# EAGLE design motherboard (EAGLE 7.2.0)
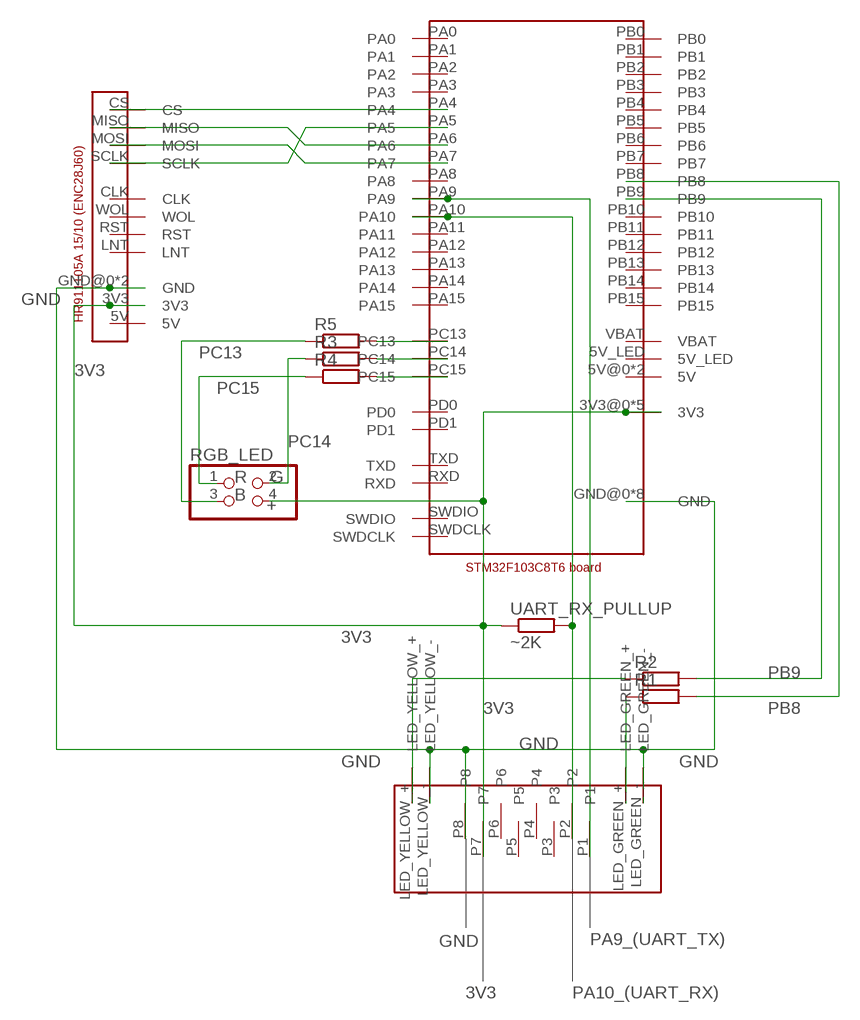
[diagram p0: schematic, sheet 1]

## Parts
R1  R-EU_R1206  [R1206]
R2  R-EU_R1206  [R1206]
R3  R-EU_R1206  [R1206]
R4  R-EU_R1206  [R1206]
R5  R-EU_R1206  [R1206]
RGB_LED  PINHD-2X2  [2X02]
U$1  HANRUN_HR911105A_15/10  [HANRUN_HR911105A_15/10]
U$2  STM32F103C8T6_BOARD_BLACK  [STM32F103C8T6_BOARD_BLACK]
U$3  RJHSE-5481_(RJ45)  [RJHSE-5481_(RJ45)]
UART_RX_PULLUP  ~2K  R-EU_R1206  [R1206]

## Nets
3V3: RGB_LED.4 U$1.3V3 U$2.3V3@0(3V3) U$2.3V3@1(3V3) U$2.3V3@2(3V3) U$2.3V3@3(3V3) U$2.3V3@4(3V3) U$3.P7 UART_RX_PULLUP.1
GND: U$1.GND@0(GND) U$1.GND@1(GND) U$2.GND@0(GND) U$2.GND@1(GND) U$2.GND@2(GND) U$2.GND@3(GND) U$2.GND@4(GND) U$2.GND@5(GND) U$2.GND@6(GND) U$2.GND@7(GND) U$3.LED_GREEN_- U$3.LED_YELLOW_- U$3.P8
N$2: U$1.CS U$2.PA4
N$3: U$1.SCLK U$2.PA5
N$4: U$1.MISO U$2.PA6
N$5: U$1.MOSI U$2.PA7
N$9: R1.1 U$3.LED_GREEN_+
N$16: R4.2 U$2.PC15
N$17: R3.2 U$2.PC14
N$18: R5.2 U$2.PC13
PA9_(UART_TX): U$2.PA9 U$3.P1
PA10_(UART_RX): U$2.PA10 U$3.P2 UART_RX_PULLUP.2
PB8: R1.2 U$2.PB8
PB9: R2.2 U$2.PB9
PB9R: R2.1 U$3.LED_YELLOW_+
PC13: R5.1 RGB_LED.3
PC14: R3.1 RGB_LED.2
PC15: R4.1 RGB_LED.1
Unconnected: U$1.5V U$1.CLK U$1.LNT U$1.RST U$1.WOL U$2.5V@0(5V) U$2.5V@1(5V) U$2.5V_LED U$2.PA0 U$2.PA1 U$2.PA2 U$2.PA3 U$2.PA8 U$2.PA11 U$2.PA12 U$2.PA13 U$2.PA14 U$2.PA15 U$2.PB0 U$2.PB1 U$2.PB2 U$2.PB3 U$2.PB4 U$2.PB5 U$2.PB6 U$2.PB7 U$2.PB10 U$2.PB11 U$2.PB12 U$2.PB13 U$2.PB14 U$2.PB15 U$2.PD0 U$2.PD1 U$2.RXD U$2.SWDCLK U$2.SWDIO U$2.TXD U$2.VBAT U$3.P3 U$3.P4 U$3.P5 U$3.P6

## Notes on the sheet
- R | G
- B
- +

## Library data of the parts
R1-R5 UART_RX_PULLUP = resistor:R-EU_: RESISTOR, European symbol
RGB_LED = pinhead:PINHD-2X2: PIN HEADER
U$1 = ut-boards:HANRUN_HR911105A_15/10
U$2 = ut-boards:STM32F103C8T6_BOARD_BLACK
U$3 = ut-connectors:RJHSE-5481_(RJ45)

## Board
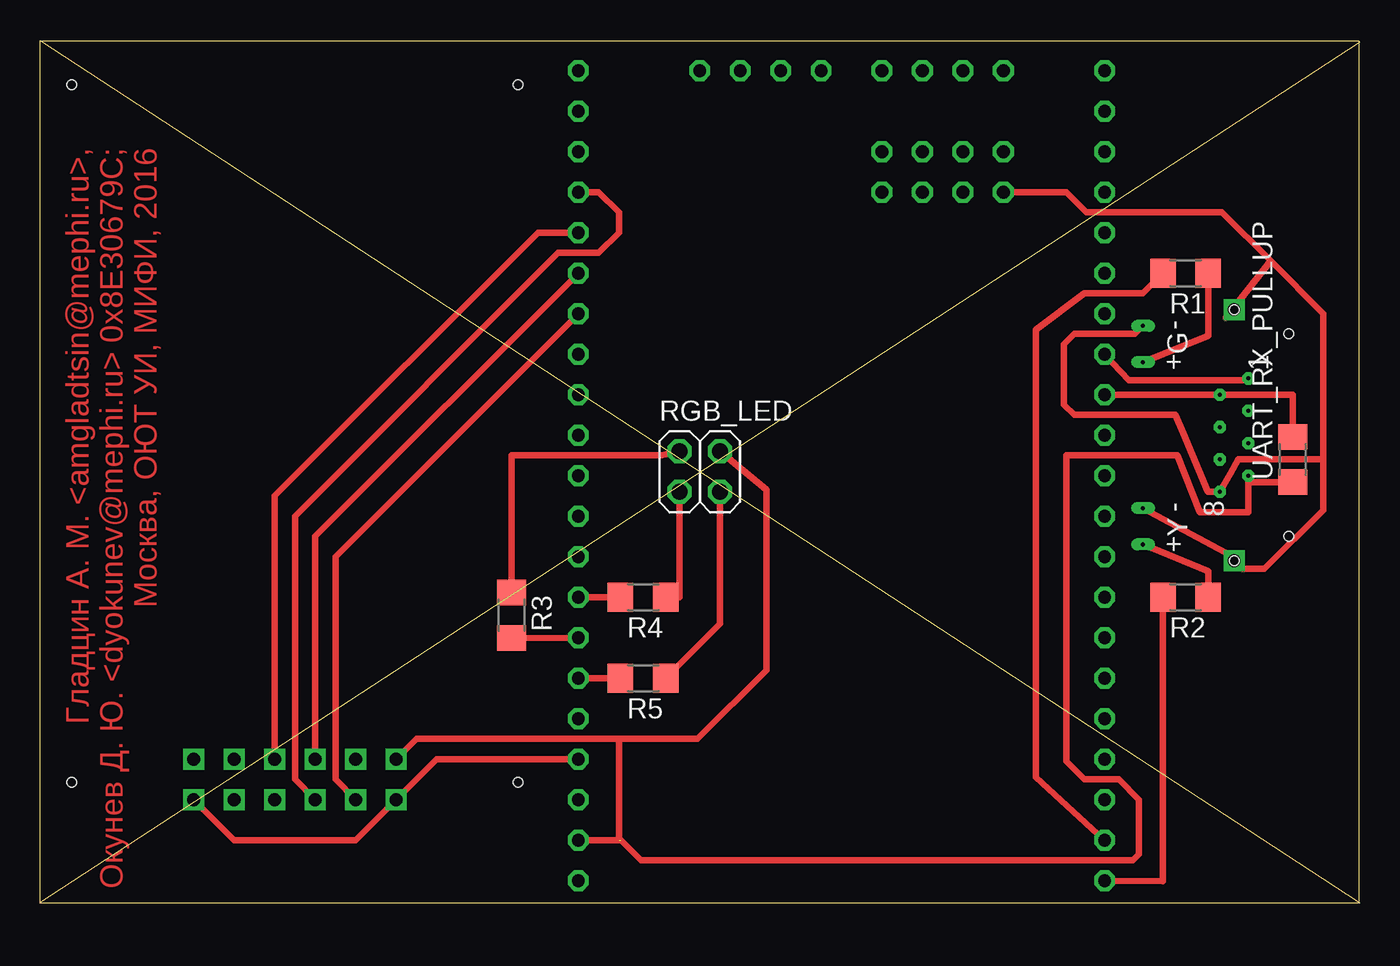
[diagram p1: board, top side]
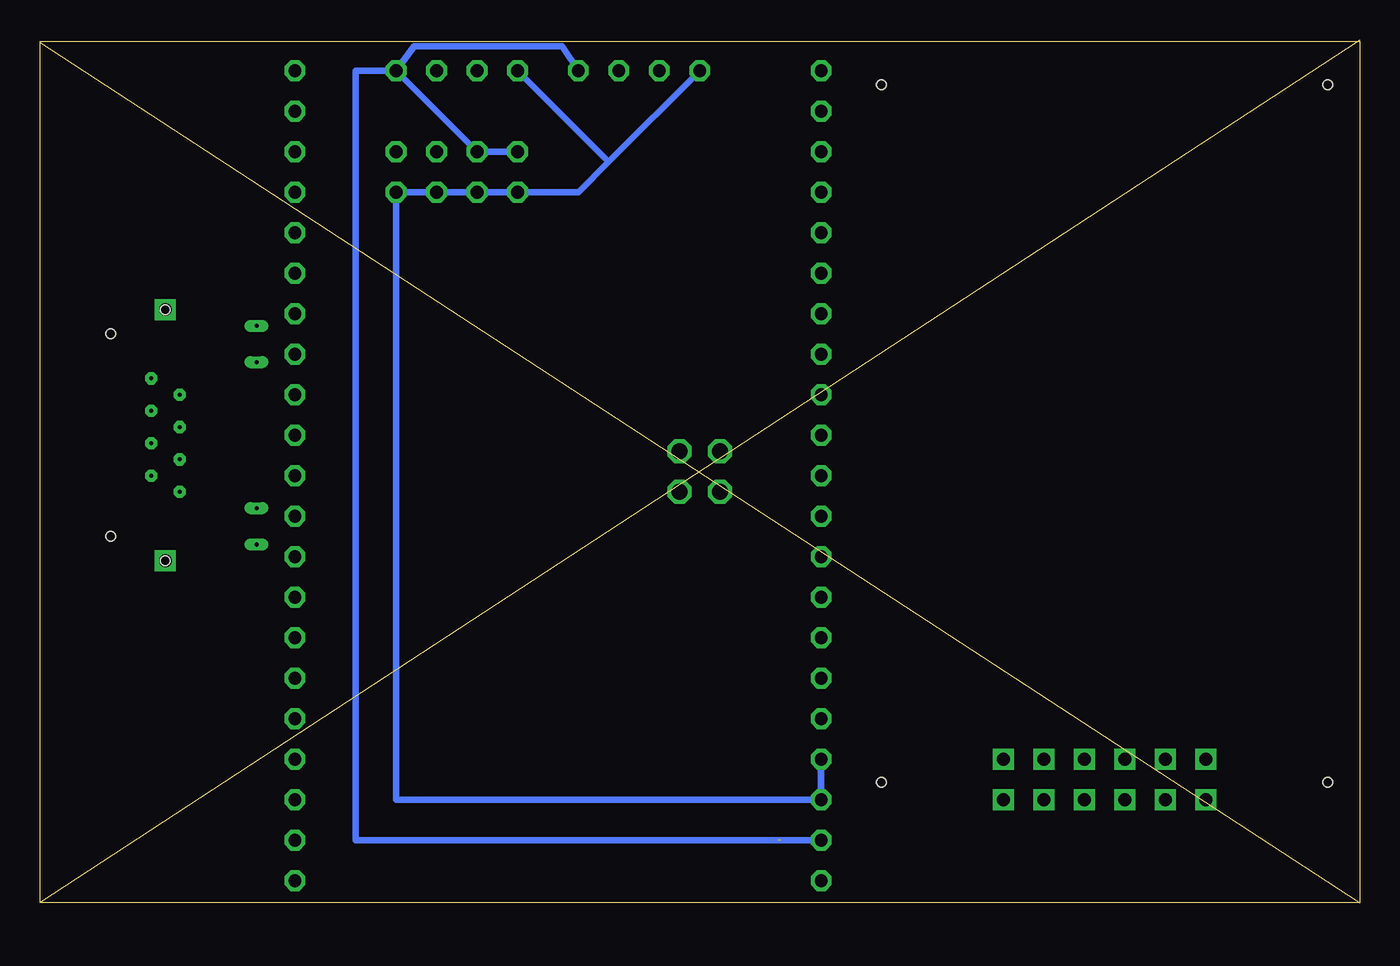
[diagram p2: board, bottom side, seen from below]

Size 82.8 x 54.1 mm. Coordinates in mm from the lower left corner, seen from the top.
Outline: 0,0 82.78,0 82.78,54.03 0,54.03 0,0
Outline: 0,54.1 82.8,0
Outline: 82.8,53.98 0,0
Copper layers (1*16): Top 0.035mm / dielectric 1.5mm / Bottom 0.035mm
Design rules "default": minimum track width 10mil, minimum drill 24mil, track to track 8mil, track to pad 8mil, pad to pad 8mil, via to via 8mil, smd to smd 8mil, copper to edge 40mil, drill to drill 8mil, minimum pad ring 10mil, minimum via ring 8mil, stop-mask expansion 4mil, vias tented up to drill 0mil, thermal gap 10mil

### Footprints (pad centres in the part's own frame; a part is rotated, then mirrored left to right if it is on the bottom)
R1206 = smd 1.6 x 1.803: 1 -1.422,0; 2 1.422,0
2X02 = drill 1.016 octagon: 1 -1.27,-1.27; 2 -1.27,1.27; 3 1.27,-1.27; 4 1.27,1.27
HANRUN_HR911105A_15/10 = drill 0.8 square: 3V3 -6.35,-19.05; 5V 6.35,-19.05; CLK 3.81,-21.59; CS -3.81,-21.59; GND@0 -6.35,-21.59; GND@1 6.35,-21.59; LNT 3.81,-19.05; MISO 1.27,-19.05; MOSI -1.27,-21.59; RST -3.81,-19.05; SCLK -1.27,-19.05; WOL 1.27,-21.59 | hole 0.6: -14,-20.5; 14,-20.5; -14,23.25; 14,23.25
STM32F103C8T6_BOARD_BLACK = drill 0.8 octagon: 3V3@0 -10.16,25.4; 3V3@1 16.51,-22.86; 3V3@2 -2.54,20.32; 3V3@3 -5.08,20.32; 3V3@4 1.27,25.4; 5V@0 -10.16,20.32; 5V@1 -7.62,20.32; 5V_LED 16.51,-25.4; GND@0 -2.54,25.4; GND@1 -2.54,17.78; GND@2 -5.08,17.78; GND@3 -7.62,17.78; GND@4 -10.16,17.78; GND@5 8.89,25.4; GND@6 16.51,-20.32; GND@7 16.51,-17.78; PA0 16.51,0; PA1 16.51,2.54; PA2 16.51,5.08; PA3 16.51,7.62; PA4 16.51,10.16; PA5 16.51,12.7; PA6 16.51,15.24; PA7 16.51,17.78; PA8 -16.51,10.16; PA9 -16.51,7.62; PA10 -16.51,5.08; PA11 -16.51,2.54; PA12 -16.51,0; PA13 -16.51,-2.54; PA14 -16.51,-5.08; PA15 -16.51,-7.62; PB0 16.51,20.32; PB1 16.51,22.86; PB2 16.51,25.4; PB3 -16.51,-10.16; PB4 -16.51,-12.7; PB5 -16.51,-15.24; PB6 -16.51,-17.78; PB7 -16.51,-20.32; PB8 -16.51,-22.86; PB9 -16.51,-25.4; PB10 -16.51,25.4; PB11 -16.51,22.86; PB12 -16.51,20.32; PB13 -16.51,17.78; PB14 -16.51,15.24; PB15 -16.51,12.7; PC13 16.51,-12.7; PC14 16.51,-10.16; PC15 16.51,-7.62; PD0 16.51,-5.08; PD1 16.51,-2.54; RXD 3.81,25.4; SWDCLK -5.08,25.4; SWDIO -7.62,25.4; TXD 6.35,25.4; VBAT 16.51,-15.24
RJHSE-5481_(RJ45) = drill 0.8 square: GND1 -7.874,0.889; GND2 7.874,0.889 | drill 0.254 long: LED_GREEN_+ 4.572,6.604; LED_GREEN_- 6.858,6.604; LED_YELLOW_+ -6.858,6.604; LED_YELLOW_- -4.572,6.604 | drill 0.254 octagon: P1 3.556,0; P2 2.54,1.778; P3 1.524,0; P4 0.508,1.778; P5 -0.508,0; P6 -1.524,1.778; P7 -2.54,0; P8 -3.556,1.778 | hole 0.6: -6.35,-2.54; 6.35,-2.54; 7.874,0.889; -7.874,0.889

### Placement (x,y rotation side)
R1  71.88,39.5 180 top
R2  71.88,19.18 180 top
R3  29.59,18.03 270 top
R4  37.85,19.18 180 top
R5  37.85,14.1 180 top
RGB_LED  41.4,27.05 0 top
U$1  16,28.07 0 bottom
U$2  50.29,26.8 0 bottom
U$3  75.82,29.34 90 top
UART_RX_PULLUP  78.61,27.81 90 top

### Tracks (layer width: path | path; a pad name or v marks a point on that pad's centre or on a via)
3V3  (1 unrouted)
  Top 0.406: U$1.3V3 23.62,10.29 36.32,10.29 | 36.32,10.29 36.32,3.94 U$2.3V3@1 | 36.45,3.94 37.72,2.67 68.58,2.67 68.96,3.05 68.96,6.48 67.69,7.75 65.53,7.75 64.39,8.89 64.39,28.07 71.37,28.07 72.77,24.51 75.82,24.51 U$3.P7 75.82,26.39 UART_RX_PULLUP.1 | 36.32,10.29 41.27,10.29 45.59,14.61 45.59,25.91 RGB_LED.4
  Bottom 0.406: U$2.3V3@1 62.99,3.94 62.99,52.2 U$2.3V3@0 | U$2.3V3@0 U$2.3V3@3 U$2.3V3@2 | U$2.3V3@4 50.04,53.72 59.31,53.72 U$2.3V3@0
GND
  Top 0.406: U$2.GND@7 24.89,9.02 U$1.GND@0 19.81,3.94 12.19,3.94 U$1.GND@1 | U$2.GND@4 64.39,44.58 65.66,43.31 74.17,43.31 77.22,40.26 | 77.22,40.26 80.52,36.96 80.52,27.81 | 80.52,27.81 75.18,27.81 74.68,26.92 U$3.P8 73.28,25.78 71.75,29.46 71.25,30.61 64.9,30.61 64.26,31.24 64.26,35.05 64.9,35.69 68.71,35.69 U$3.LED_GREEN_- | 77.22,40.26 74.42,36.7 | 80.52,27.81 80.52,24.64 76.83,20.95 75.44,20.95 74.42,21.97 U$3.LED_YELLOW_-
  Bottom 0.406: 47.12,46.48 49.02,44.58 U$2.GND@1 U$2.GND@2 U$2.GND@3 U$2.GND@4 60.45,6.48 U$2.GND@6 U$2.GND@7 | 47.12,46.48 U$2.GND@5 | U$2.GND@0 47.12,46.48
N$2
  Top 0.406: U$1.CS 18.54,7.75 18.54,21.72 U$2.PA4
N$3
  Top 0.406: U$1.SCLK 17.27,22.99 U$2.PA5
N$4
  Top 0.406: U$1.MISO 14.73,25.53 31.24,42.04 U$2.PA6
N$5
  Top 0.406: U$2.PA7 35.05,44.58 36.32,43.31 36.32,42.04 35.05,40.77 32.51,40.77 16,24.26 16,7.75 U$1.MOSI
N$9
  Top 0.406: U$3.LED_GREEN_+ 73.3,35.59 R1.1
N$16
  Top 0.406: R4.2 U$2.PC15
N$17
  Top 0.406: U$2.PC14 R3.2
N$18
  Top 0.406: U$2.PC13 R5.2
PA9_(UART_TX)
  Top 0.406: U$2.PA9 68.33,32.77 75.56,32.77 U$3.P1
PA10_(UART_RX)
  Top 0.406: U$2.PA10 U$3.P2 78.61,31.88 UART_RX_PULLUP.2
PB8
  Top 0.406: U$2.PB8 62.48,7.87 62.48,35.94 65.53,38.23 69.19,38.23 R1.2
PB9
  Top 0.406: U$2.PB9 70.46,1.37 R2.2
PB9R
  Top 0.406: R2.1 73.3,20.8 U$3.LED_YELLOW_+
PC13
  Top 0.406: R5.1 42.67,17.5 RGB_LED.3
PC14
  Top 0.406: R3.1 29.59,28.07 38.99,28.07 RGB_LED.2
PC15
  Top 0.406: R4.1 40.13,19.18 RGB_LED.1

### Text on the board
Top: Гладцин А. М. <amgladtsin@mephi.ru>, / Окунев Д. Ю. <dyokunev@mephi.ru> 0x8E30679C; / Москва, ОЮТ УИ, МИФИ, 2016